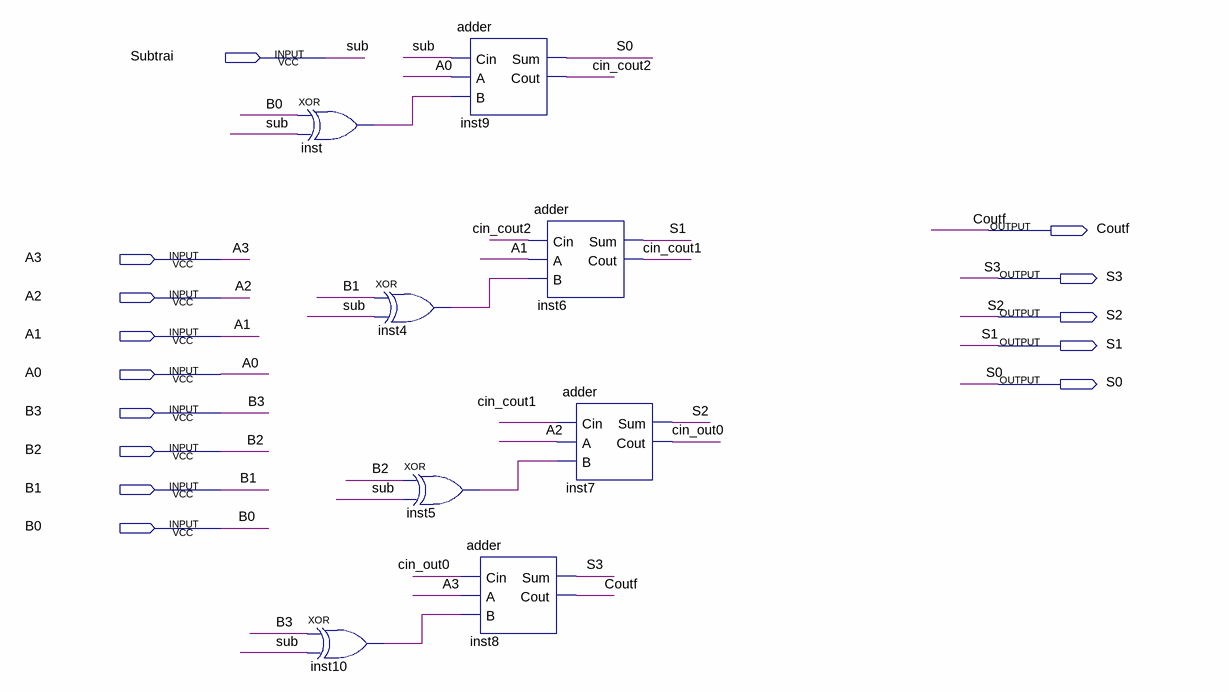
[diagram p0: schematic sheet]
// Quartus schematic addsub.bdf as structural Verilog: 8 symbols, 14 pins
module addsub (
  input  Subtrai,
  input  A3,
  input  A2,
  input  A1,
  input  A0,
  input  B3,
  input  B2,
  input  B1,
  input  B0,
  output Coutf,
  output S3,
  output S2,
  output S1,
  output S0
);

  wire cin_cout1, cin_cout2, cin_out0, inst4_out, inst5_out, inst10_out, inst_out;

  xor inst (inst_out, B0, Subtrai);
  xor inst10 (inst10_out, B3, Subtrai);
  xor inst4 (inst4_out, B1, Subtrai);
  xor inst5 (inst5_out, B2, Subtrai);
  adder inst9 (.Cin(Subtrai), .A(A0), .B(inst_out), .Sum(S0), .Cout(cin_cout2));
  adder inst8 (.Cin(cin_out0), .A(A3), .B(inst10_out), .Sum(S3), .Cout(Coutf));
  adder inst6 (.Cin(cin_cout2), .A(A1), .B(inst4_out), .Sum(S1), .Cout(cin_cout1));
  adder inst7 (.Cin(cin_cout1), .A(A2), .B(inst5_out), .Sum(S2), .Cout(cin_out0));

  // Other names for the same wires on the sheet: sub = Subtrai
endmodule
